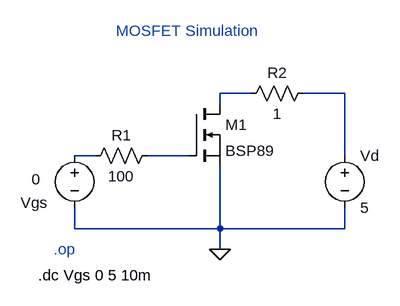
[diagram p0: schematic Mosfet_Simulation.asc]
Mosfet_Simulation.asc, the LTspice schematic file:
Version 4.1
SHEET 1 880 680
WIRE 272 80 224 80
WIRE 416 80 352 80
WIRE 224 96 224 80
WIRE 32 176 0 176
WIRE 176 176 112 176
WIRE 416 176 416 80
WIRE 0 288 0 256
WIRE 224 288 224 192
WIRE 224 288 0 288
WIRE 416 288 416 256
WIRE 416 288 224 288
WIRE 224 320 224 288
FLAG 224 320 0
SYMBOL voltage 416 160 R0
WINDOW 123 0 0 Left 0
WINDOW 39 0 0 Left 0
SYMATTR InstName Vd
SYMATTR Value 5
SYMBOL voltage 0 160 R0
WINDOW 0 -83 88 Left 2
WINDOW 3 -66 52 Left 2
WINDOW 123 0 0 Left 0
WINDOW 39 0 0 Left 0
SYMATTR InstName Vgs
SYMATTR Value 0
SYMBOL res 128 160 R90
WINDOW 0 0 56 VBottom 2
WINDOW 3 32 56 VTop 2
SYMATTR InstName R1
SYMATTR Value 100
SYMBOL res 368 64 R90
WINDOW 0 0 56 VBottom 2
WINDOW 3 32 56 VTop 2
SYMATTR InstName R2
SYMATTR Value 1
SYMBOL nmos 176 96 R0
SYMATTR InstName M1
SYMATTR Value BSP89
TEXT 64 -16 Left 2 ;MOSFET Simulation
TEXT -32 320 Left 2 ;.op
TEXT -56 360 Left 2 !.dc Vgs 0 5 10m

The netlist it stands for:
* Mosfet_Simulation.asc
Vd N002 0 5
Vgs N003 0 0
R1 N004 N003 100
R2 N002 N001 1
M1 N001 N004 0 0 BSP89
.model NMOS NMOS
.model PMOS PMOS
.lib standard.mos
* MOSFET Simulation
* .op
.dc Vgs 0 5 10m
.backanno
.end